# EAGLE board Placa_main_f3 (EAGLE 9.6.2)
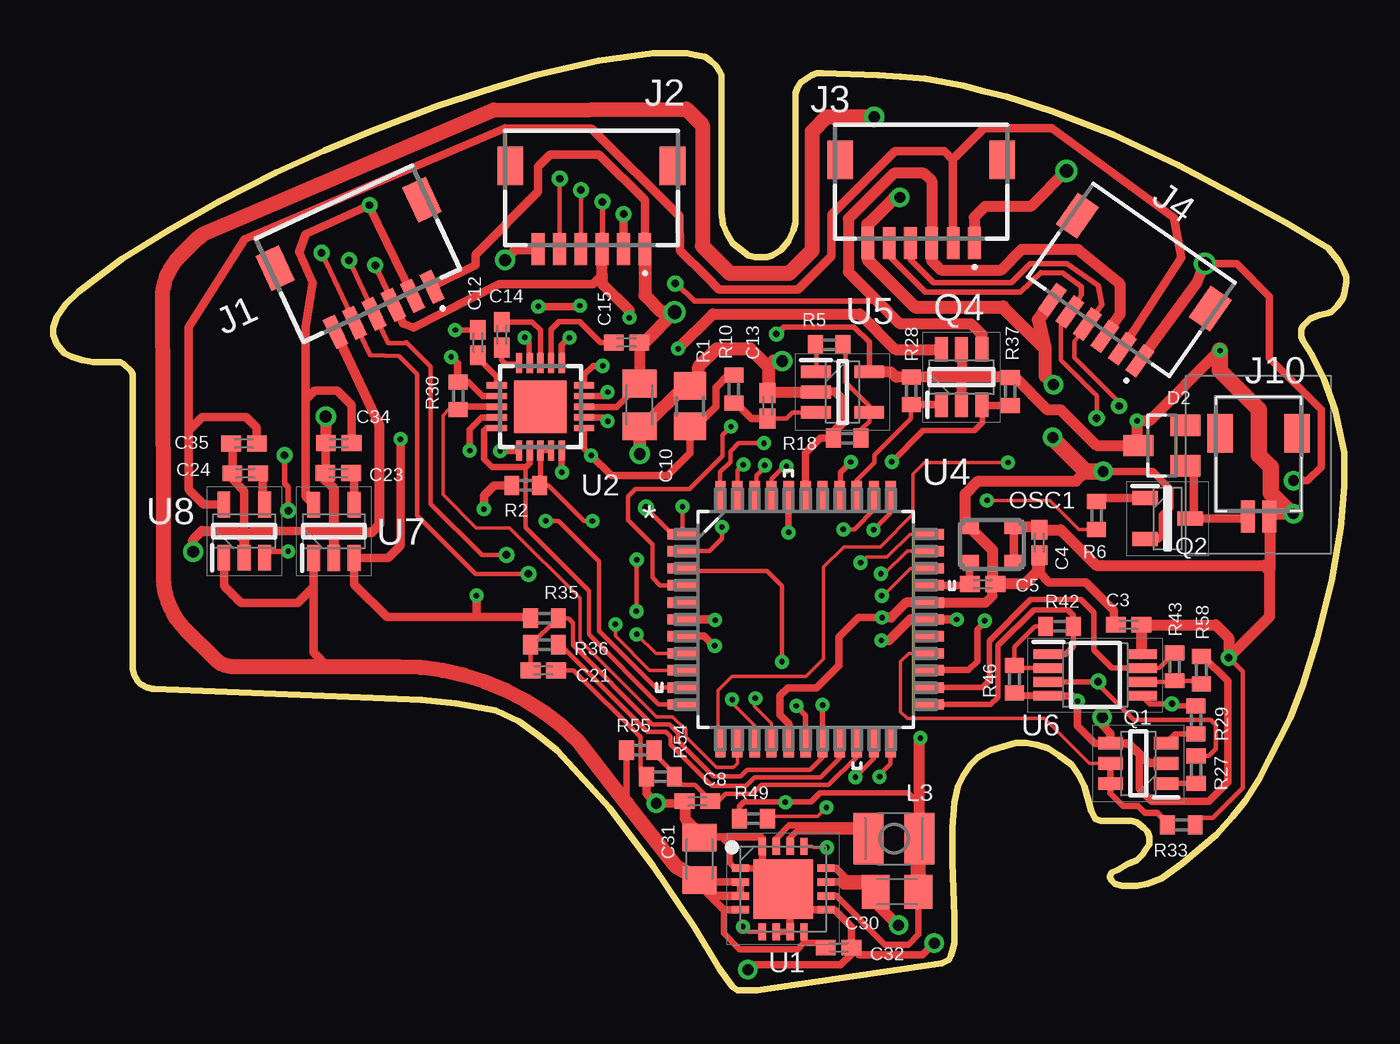
[diagram p7: board, top side]
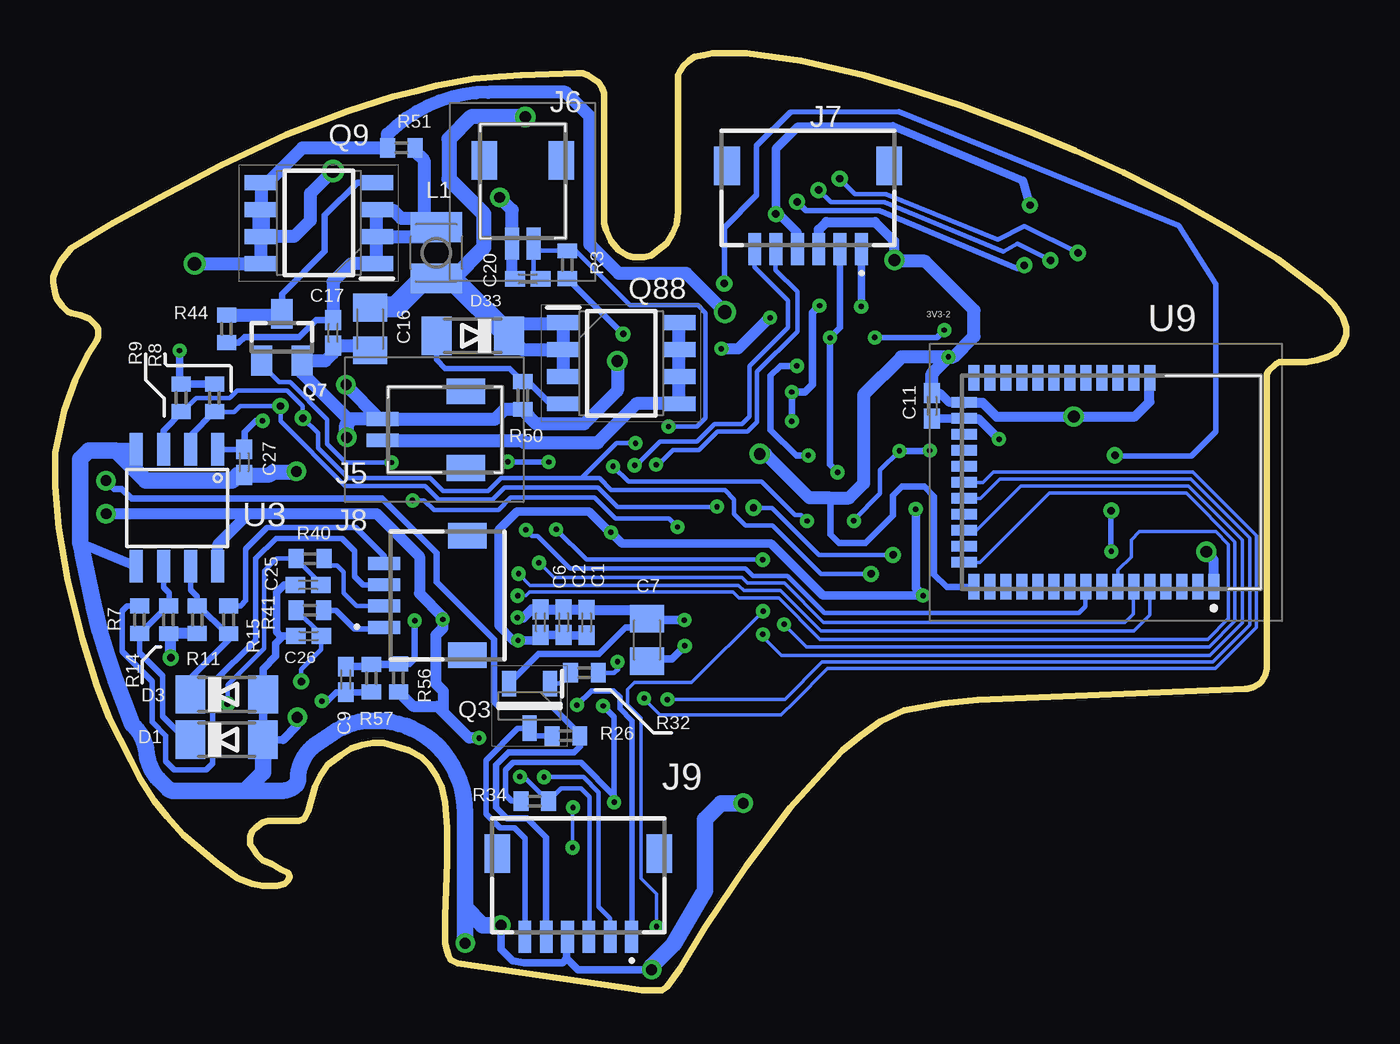
[diagram p8: board, bottom side, seen from below]

Size 60.62 x 43.94 mm. Coordinates in mm from the lower left corner, seen from the top.
Outline: 3.73,28.87 3.73,15.16 arc90 4.74,14.14 17.27,13.63 18.88,13.46 20.74,13.12 21.84,12.62 22.78,11.94 23.62,11.26 24.38,10.41 26.08,8.55 28.11,5.84 30.06,2.96 31.24,1.02 31.84,0.17 32.09,0 33.02,0 41.66,1.27 42,1.44 42.08,1.61 42.16,1.86 42.25,2.2 42.25,3.47 42.16,6.01 42.16,7.62 42.25,8.81 42.42,9.57 42.67,10.08 43.01,10.58 43.35,10.92 43.94,11.26 45.13,11.6 45.64,11.6 46.14,11.51 46.65,11.35 47.16,11.01 47.75,10.58 48.09,10.08 48.35,9.57 48.51,8.97 48.68,8.38 48.85,8.04 49.11,7.96 50.55,7.96 50.8,7.87 51.14,7.62 51.31,7.45 51.39,7.2 51.39,6.86 51.22,6.6 51.05,6.35 50.8,6.1 50.38,5.93 49.95,5.67 49.62,5.5 49.53,5.33 49.62,5.16 49.78,5 50.12,4.91 50.8,4.91 51.31,5 51.99,5.25 52.32,5.5 52.92,5.93 54.53,7.28 55.29,8.13 55.88,8.89 56.56,9.91 56.98,10.75 58,12.78 58.59,14.31 59.27,16.51 59.94,19.22 60.37,21.67 60.54,23.62 60.54,25.23 60.11,27.18 59.61,28.62 59.01,29.8 58.59,30.48 58.51,30.65 58.51,30.99 58.59,31.16 58.93,31.5 59.35,31.67 59.78,31.75 59.94,31.83 60.2,32.09 60.45,32.43 60.54,32.68 60.62,33.19 60.62,33.44 60.54,33.7 60.28,34.21 59.78,34.8 57.83,35.98 55.63,37.17 52.75,38.69 49.7,40.13 46.82,41.23 44.7,41.91 43.6,42.16 42.67,42.42 40.89,42.76 39.71,42.84 38.69,42.93 36.07,43.01 35.81,43.01 35.56,42.93 35.31,42.76 35.05,42.59 34.88,42.33 34.8,42.08 34.8,35.98 34.71,35.64 34.46,35.14 34.12,34.71 33.7,34.46 33.44,34.37 32.94,34.37 32.6,34.46 32.26,34.71 31.84,35.05 31.58,35.48 31.41,35.9 31.33,36.49 31.33,42.93 31.24,43.1 31.07,43.35 30.82,43.6 30.56,43.77 30.14,43.86 29.72,43.94 28.11,43.94 25.57,43.6 22.61,42.93 20.66,42.33 18.03,41.49 14.9,40.3 12.7,39.37 10.41,38.35 7.79,37 5.42,35.64 3.22,34.29 1.19,32.77 0.59,32.17 0.17,31.58 0,31.07 0,30.73 0.17,30.31 0.51,29.89 0.85,29.72 1.35,29.55 1.86,29.46 3.13,29.46 3.3,29.38 3.64,29.04 3.73,28.87
Copper layers (1*16): Top 0.035mm / dielectric 1.5mm / Bottom 0.035mm
Design rules "default *": minimum track width 6mil, minimum drill 10mil, track to track 6mil, track to pad 6mil, pad to pad 6mil, via to via 6mil, smd to smd 6mil, copper to edge 6mil, drill to drill 6mil, minimum pad ring 10mil, minimum via ring 8mil, stop-mask expansion 6mil, vias tented up to drill 0mil, thermal gap 6mil

## Footprints (pad centres in the part's own frame; a part is rotated, then mirrored left to right if it is on the bottom)
C0402K = smd 0.925 x 0.74: 1 -0.6,0; 2 0.6,0
C0805K = smd 1.3 x 1.6: 1 -1,0; 2 1,0
MINIMELF = smd 1.4 x 1.8: A 1.7,0; C -1.7,0
SOT23 = smd 1 x 1.4: 1 -0.95,-1.1; 2 0.95,-1.1; 3 0,1.1
501568-0607 = smd 0.6 x 1.5: 1 -2.5,0.2; 2 -1.5,0.2; 3 -0.5,0.2; 4 0.5,0.2; 5 1.5,0.2; 6 2.5,0.2 | smd 1.2 x 1.8: 7 -3.8,-3.7; 8 3.8,-3.7
5015680207 = smd 0.65 x 1.5: 1 -0.5,2.8; 2 0.5,2.8 | smd 1.2 x 1.8: MP1 -1.8,-1.1; MP2 1.8,-1.1
501568-0407 = smd 0.6 x 1.5: 1 -1.5,0.3; 2 -0.5,0.3; 3 0.5,0.3; 4 1.5,0.3 | smd 1.2 x 1.8: 5 -2.8,-3.6; 6 2.8,-3.6
L2825P = smd 1.4 x 2.4: 1 -1.2,0; 2 1.2,0
ASE = smd 0.9 x 0.65: 1 -1.05,-0.825; 2 1.05,-0.825; 3 1.05,0.825; 4 -1.05,0.825
SOT95P285X140-6N = smd 1.15 x 0.6: 1 -1.3,0.95; 2 -1.3,0; 3 -1.3,-0.95; 4 1.3,-0.95; 5 1.3,0; 6 1.3,0.95
SOT96P240X110-3N = smd 1.2 x 0.65: 1 -1.05,0.96; 2 -1.05,-0.96; 3 1.05,0
SOIC127P600X175-8N = smd 1.525 x 0.7: 1 -2.712,1.905; 2 -2.712,0.635; 3 -2.712,-0.635; 4 -2.712,-1.905; 5 2.712,-1.905; 6 2.712,-0.635; 7 2.712,0.635; 8 2.712,1.905
R0805 = smd 1.3 x 1.5: 1 -0.95,0; 2 0.95,0
R0402 = smd 0.7 x 0.9: 1 -0.65,0; 2 0.65,0
QFN65P400X400X100-17N = smd 0.8 x 0.35: 1 -2,0.975; 2 -2,0.325; 3 -2,-0.325; 4 -2,-0.975; 9 2,-0.975; 10 2,-0.325; 11 2,0.325; 12 2,0.975 | smd 0.35 x 0.8: 5 -0.975,-2; 6 -0.325,-2; 7 0.325,-2; 8 0.975,-2; 13 0.975,2; 14 0.325,2; 15 -0.325,2; 16 -0.975,2 | smd 2.8 x 2.8: 17 0,0
QFN20 = smd 0.95 x 0.3: 1 -2.05,1; 2 -2.05,0.5; 3 -2.05,0; 4 -2.05,-0.5; 5 -2.05,-1; 11 2.05,-1; 12 2.05,-0.5; 13 2.05,0; 14 2.05,0.5; 15 2.05,1 | smd 0.3 x 0.95: 6 -1,-2.05; 7 -0.5,-2.05; 8 0,-2.05; 9 0.5,-2.05; 10 1,-2.05; 16 1,2.05; 17 0.5,2.05; 18 0,2.05; 19 -0.5,2.05; 20 -1,2.05 | smd 2.45 x 2.45: EXP 0,0
SO8-COOL = smd 0.61 x 1.524: 1 -1.905,-2.743; 2 -0.635,-2.743; 3 0.635,-2.743; 4 1.905,-2.743; 5 1.905,2.743; 6 0.635,2.743; 7 -0.635,2.743; 8 -1.905,2.743
QFP80P1200X1200X120-44N = smd 1.473 x 0.483: 1 -5.74,3.988; 2 -5.74,3.2; 3 -5.74,2.388; 4 -5.74,1.6; 5 -5.74,0.787; 6 -5.74,0; 7 -5.74,-0.787; 8 -5.74,-1.6; 9 -5.74,-2.388; 10 -5.74,-3.2; 11 -5.74,-3.988; 23 5.74,-3.988; 24 5.74,-3.2; 25 5.74,-2.388; 26 5.74,-1.6; 27 5.74,-0.787; 28 5.74,0; 29 5.74,0.787; 30 5.74,1.6; 31 5.74,2.388; 32 5.74,3.2; 33 5.74,3.988 | smd 0.483 x 1.473: 12 -3.988,-5.74; 13 -3.2,-5.74; 14 -2.388,-5.74; 15 -1.6,-5.74; 16 -0.787,-5.74; 17 0,-5.74; 18 0.787,-5.74; 19 1.6,-5.74; 20 2.388,-5.74; 21 3.2,-5.74; 22 3.988,-5.74; 34 3.988,5.74; 35 3.2,5.74; 36 2.388,5.74; 37 1.6,5.74; 38 0.787,5.74; 39 0,5.74; 40 -0.787,5.74; 41 -1.6,5.74; 42 -2.388,5.74; 43 -3.2,5.74; 44 -3.988,5.74
SOT95P270X145-5N = smd 1.4 x 0.6: 1 -1.25,0.95; 2 -1.25,0; 3 -1.25,-0.95; 4 1.25,-0.95; 5 1.25,0.95
SOP65P490X110-8N = smd 1.4 x 0.45: 1 -2.2,0.975; 2 -2.2,0.325; 3 -2.2,-0.325; 4 -2.2,-0.975; 5 2.2,-0.975; 6 2.2,-0.325; 7 2.2,0.325; 8 2.2,0.975
SOT95P280X145-5N = smd 1.2 x 0.6: 1 -1.25,0.95; 2 -1.25,0; 3 -1.25,-0.95; 4 1.25,-0.95; 5 1.25,0.95
45300005 = smd 1.2 x 0.5: 1 4.9,4.8; 2 4.9,4.05; 3 4.9,3.3; 4 4.9,2.55; 5 4.9,1.8; 6 4.9,1.05; 7 4.9,0.3; 8 4.9,-0.45; 9 4.9,-1.2; 10 4.9,-1.95; 11 4.9,-2.7; 12 4.9,-3.45; 13 4.9,-4.2; 14 4.9,-4.95; 15 4.9,-5.7; 16 4.9,-6.45; 28 -4.9,-6.45; 29 -4.9,-5.7; 30 -4.9,-4.95; 31 -4.9,-4.2; 32 -4.9,-3.45; 33 -4.9,-2.7; 34 -4.9,-1.95; 35 -4.9,-1.2; 36 -4.9,-0.45; 37 -4.9,0.3; 38 -4.9,1.05; 39 -4.9,1.8 | smd 0.5 x 1.2: 17 3.75,-6.9; 18 3,-6.9; 19 2.25,-6.9; 20 1.5,-6.9; 21 0.75,-6.9; 22 0,-6.9; 23 -0.75,-6.9; 24 -1.5,-6.9; 25 -2.25,-6.9; 26 -3,-6.9; 27 -3.75,-6.9

## Placement (x,y rotation side)
C1  0.1uF  [C0402K]  35.61,17.25 90 bottom
C2  0.1uF  [C0402K]  36.69,17.26 90 bottom
C3  0.1uF  [C0402K]  50.42,17.15 180 top
C4  0.1uF  [C0402K]  46.23,21 270 top
C5  10pF  [C0402K]  43.57,19.05 0 top
C6  0.1uF  [C0402K]  37.78,17.26 90 bottom
C7  10uF  [C0805K]  32.78,16.43 90 bottom
C8  0.1uF  [C0402K]  30.2,8.87 180 top
C9  0.1uF  [C0402K]  46.9,14.58 270 bottom
C10  10uF  [C0805K]  27.48,27.45 90 top
C11  0.1uF  [C0402K]  19.42,27.41 270 bottom
C12  0.1uF  [C0402K]  19.91,30.38 270 top
C13  1uF  [C0402K]  33.49,27.41 90 top
C14  0.1uF  [C0402K]  21.03,30.74 270 top
C15  0.1uF  [C0402K]  26.88,30.38 180 top
C16  10uF  [C0805K]  45.76,31.01 270 bottom
C17  1uF  [C0402K]  47.5,30.83 270 bottom
C20  10uF  [C0402K]  38.37,33.36 180 bottom
C21  0.1uF  [C0402K]  22.97,15.01 0 top
C23  470pF  [C0402K]  13.36,24.25 180 top
C24  470pF  [C0402K]  9,24.25 180 top
C25  1uF  [C0402K]  48.68,19.02 180 bottom
C26  1uF  [C0402K]  48.65,16.62 180 bottom
C27  0.1uF  [C0402K]  51.67,24.77 270 bottom
C30  22uF  [C0805K]  39.56,4.63 180 top
C31  10uF  [C0805K]  30.3,6.17 90 top
C32  1uF  [C0402K]  36.82,2.01 0 top
C34  2.2uF  [C0402K]  13.38,25.66 180 top
C35  2.2uF  [C0402K]  8.94,25.65 180 top
D1  BZT52C3V3LP-7  [MINIMELF]  52.49,11.75 0 bottom
D2  BAT54HT1G  [SOT23]  51.98,25.55 90 top
D3  BZT52C3V3LP-7  [MINIMELF]  52.49,13.88 0 bottom
D33  PLZ9V1A-G3/H  [MINIMELF]  40.95,30.7 180 bottom
J1  501568-0607  [501568-0607]  15.41,32.12 205 top
J2  501568-0607  [501568-0607]  25.23,34.96 180 top
J3  501568-0607  [501568-0607]  40.69,35.24 180 top
J4  501568-0607  [501568-0607]  49.01,31.12 145 top
J5  501568-0207  [5015680207]  42.38,26.29 90 bottom
J6  501568-0207  [5015680207]  38.61,37.82 180 bottom
J7  501568-0607  [501568-0607]  25.23,34.96 180 bottom
J8  501568-0407  [501568-0407]  44.81,18.52 90 bottom
J9  501568-0607  [501568-0607]  36.01,2.72 180 bottom
J10  501568-0207  [5015680207]  56.51,25.02 180 top
L1  68uH  [L2825P]  42.67,34.59 90 bottom
L3  6.8uH  [L2825P]  39.42,7.12 0 top
OSC1  ASDAIG-32.000MHZ-X-K-S-T  [ASE]  44,20.91 180 top
Q1  DMN2215UDM-7  [SOT95P285X140-6N]  50.87,10.64 180 top
Q2  DMN2300U-7DICT-ND  [SOT96P240X110-3N]  52.25,22.12 0 top
Q3  DMN2300U-7DICT-ND  [SOT96P240X110-3N]  38.29,13.34 270 bottom
Q4  DMP2240UDM-7  [SOT95P285X140-6N]  42.59,28.76 90 top
Q7  NTK3134NT1GOSCT-ND  [SOT23]  49.91,30.63 0 bottom
Q9  FDS6675BZCT-ND  [SOIC127P600X175-8N]  48.17,35.98 180 bottom
Q88  FDS6675BZCT-ND  [SOIC127P600X175-8N]  33.99,29.41 0 bottom
R1  0.033R  [R0805]  29.85,27.4 270 top
R2  4k7  [R0402]  22.15,23.68 180 top
R3  1k  [R0402]  36.52,34.03 270 bottom
R5  190k  [R0402]  36.38,30.28 0 top
R6  10k  [R0402]  48.91,22.27 90 top
R7  120R  [R0402]  56.58,17.38 270 bottom
R8  4k7  [R0402]  53.06,27.79 90 bottom
R9  4k7  [R0402]  54.63,27.79 90 bottom
R10  18k  [R0402]  31.91,28.19 90 top
R11  4k7  [R0402]  53.87,17.38 270 bottom
R14  4k7  [R0402]  55.21,17.38 270 bottom
R15  120R  [R0402]  52.4,17.38 270 bottom
R18  10k  [R0402]  37.23,25.9 180 top
R26  100R  [R0402]  36.58,11.94 0 bottom
R27  10k  [R0402]  53.59,10.35 90 top
R28  1k  [R0402]  40.23,28.11 90 top
R29  10k  [R0402]  53.57,12.68 90 top
R30  10k  [R0402]  18.98,27.88 270 top
R32  10k  [R0402]  35.72,14.89 180 bottom
R33  10k  [R0402]  52.89,7.76 0 top
R34  4k7  [R0402]  38.04,8.88 180 bottom
R35  10k  [R0402]  23.03,17.45 0 top
R36  470R  [R0402]  23.03,16.21 0 top
R37  1k  [R0402]  44.86,28.08 90 top
R40  27k  [R0402]  48.58,20.25 180 bottom
R41  27k  [R0402]  48.59,17.82 180 bottom
R42  10K  [R0402]  47.18,17.07 180 top
R43  10K  [R0402]  52.58,15.17 270 top
R44  10k  [R0402]  52.5,31.02 270 bottom
R46  100K  [R0402]  45.06,14.59 270 top
R49  1M  [R0402]  32.83,8.06 180 top
R50  2k2  [R0402]  38.61,27.9 90 bottom
R51  10k  [R0402]  44.3,39.51 180 bottom
R54  10k  [R0402]  28.46,10.02 0 top
R55  39k  [R0402]  27.52,11.26 180 top
R56  10k  [R0402]  44.44,14.65 90 bottom
R57  10k  [R0402]  45.71,14.64 90 bottom
R58  100K  [R0402]  53.83,15.02 90 top
U1  TPS62111RSAT  [QFN65P400X400X100-17N]  34.22,4.75 0 top
U2  A3906SESTR-T  [QFN20]  22.84,27.37 0 top
U3  ADUM1250  [SO8-COOL]  54.82,22.63 180 bottom
U4  DSPIC33FJ128MC804-I/PT  [QFP80P1200X1200X120-44N]  35.28,17.4 0 top
U5  MCP601T-I_OT  [SOT95P270X145-5N]  37.01,28.06 0 top
U6  MCP6002T-I_MS  [SOP65P490X110-8N]  48.85,14.79 0 top
U7  MIC5219-5.0YM5-TR  [SOT95P280X145-5N]  13.16,21.53 90 top
U8  MIC5219-5.0YM5-TR  [SOT95P280X145-5N]  8.95,21.53 90 top
U9  BL651 - 453-00005  [45300005]  11.01,23.82 270 bottom

## Tracks (layer width: path | path; a pad name or v marks a point on that pad's centre or on a via)
+3V3  (via drill 0.25, 0.3, 0.35, 0.51)
  Top 0.203: R33.2 53.86,8.08 54.36,8.08 55.77,9.49 55.77,14.95 v55.11,15.6
  Top 0.254: R49.2 32.18,8.63 32.39,8.84 34.3,8.84 v34.32,8.82 34.34,8.84 35.53,8.84 35.94,9.25 40.08,9.25 40.56,8.77 40.56,7.06 | 51.02,15.76 U6.8 | v34.84,13.34 35.28,12.9 U4.17 | U5.5 38.26,30.39 37.54,31.11 34.26,31.11 33.93,30.78 v33.9,30.78
  Top 0.305: 40.57,4.62 40.57,2.62 40.09,2.14 39,2.14 36.71,4.43 U1.10 | R35.1 22.32,17.5 | 19.84,17.52 19.86,17.5 | v34.47,21.48 34.47,23.12 U4.40 | 50.71,25.55 50.87,25.55
  Top 0.356: C30.1 40.57,4.62 | C4.1 46.09,21.74 | OSC1.1
  Top 0.406: U4.28 v42.36,17.4 v42.36,17.39 | 39.19,16.41 v38.83,16.41 | R2.2 20.66,23.68 20.19,23.21 v20.19,22.57 | OSC1.1 OSC1.4 | 22.32,17.5 19.86,17.5 15.65,17.5 14.11,19.04 U7.3 15.7,20.28 16.28,20.85 v16.28,25.85 | v19.84,18.51 19.84,17.52
  Top 0.457: U4.28 40.17,17.39 39.19,16.41 | Q4.5 42.59,28.75 Q4.2
  Top 0.508: 46.09,21.74 OSC1.1 | C4.1 47.24,21.6 48.91,19.93 56.77,19.93 57.03,19.67 | 51.02,15.76 C3.1 54.5,17.15 55.11,16.53 v55.11,15.6 57.03,17.51 57.03,19.67 | U5.5 39.27,29 39.52,28.76 R28.2 40.24,28.75 42.59,28.75 44.84,28.75 R37.2 45.11,28.73 46.62,27.22 47.24,27.22 48.91,25.55 50.71,25.55 D2.3 50.81,25.62 v50.81,26.71 51.38,26.71 54.68,30 v54.7,30 | L3.2 40.62,11.8 v40.66,11.83 | 57.03,19.67 57.03,22.2 J10.1 57.01,22.29 57.07,22.35
  Top 0.61: v58.15,22.35 57.07,22.35
  Top 0.711: C30.1 40.56,7.06 L3.2
  Top 0.762: v54.7,30 54.7,29.06 56.52,27.24 56.52,25.1 57.08,24.55 57.08,23.32 58.05,22.35 v58.15,22.35
  Bottom 0.203: 44.39,14.05 R56.1
  Bottom 0.254: C27.1 U3.1 | v34.84,13.34 34.32,12.82 v34.32,8.82 34.32,9.13 35.88,10.69 39.06,10.69 39.42,10.33 39.42,9.17 39.13,8.88 R34.2 | v33.9,30.78 33.92,30.78 R3.2
  Bottom 0.305: 34.51,21.48 v34.47,21.48 | v50.81,26.71 51.14,26.71 51.66,26.18 C27.1
  Bottom 0.356: v54.7,30 54.7,28.52 R9.2 R8.2
  Bottom 0.406: v38.83,16.41 v38.82,16.4 37.78,16.4 C6.1 C2.1 36.68,16.65 C1.1 | C11.2 U9.26 17.25,26.82 v16.28,25.85 | v20.19,22.57 20.17,22.55 20.17,18.84 v19.84,18.51 24.54,18.51 26.98,20.95 33.95,20.95 v34.47,21.48 | 39.06,16.41 39.75,17.11 39.75,21.59 38.89,22.46 35.49,22.46 34.51,21.48
  Bottom 0.457: v38.83,16.41 39.06,16.41
  Bottom 0.508: R56.1 43.76,13.32 42.61,13.32 42.34,13.06 | 42.34,13.06 42.34,14.04 42.7,14.39 42.7,16.64 42.36,16.98 v42.36,17.39 42.36,17.52 43.46,18.61 43.46,20.35 45.45,22.34 51.49,22.34 | v40.66,11.83 41.12,11.83 42.34,13.06 | U3.8 52.92,20.92 51.49,22.34 | 51.49,22.34 58.13,22.34 v58.15,22.35 | R11.2 55.21,16.73 | 55.21,16.73 R14.2 | v55.11,15.6 55.11,16.63 55.21,16.73
+3V3-1  (via drill 0.25, 0.35)
  Top 0.203: 25.75,34.77 J2.3
  Top 0.254: J1.3 v15.09,34.01 | v25.75,36.98 25.75,34.77
  Top 0.406: 25.74,33.55 25.3,33.11 20.91,33.11 16.9,31.07 16.39,31.26 J1.3
  Top 0.508: J2.3 25.74,33.55 25.74,33.15 27.01,31.88 v27.01,31.55 | v29.3,30.09 30.92,31.71 37.82,31.71 39.47,30.05 Q4.6
  Bottom 0.254: v15.09,34.01 15.41,33.85 21.89,36.57 25.33,36.57 v25.75,36.98
  Bottom 0.508: v29.3,30.09 28.51,30.09 27.05,31.55 v27.01,31.55
+3V3-2  (via drill 0.25, 0.35)
  Top 0.254: 38.69,32.27 38.68,32.27 | 38.64,32.32 30.06,32.32 29.22,33.15 v29.16,33.15 | v11.01,20.59 v11,20.58 10.2,20.58 U8.3 | v11.02,22.5 11.02,23.61 10.84,23.78 v10.84,25.09
  Top 0.508: J4.3 50.03,31.7 50.03,33.12 48.05,34.74 45.4,34.74 44.44,33.78 41.61,33.78 41.19,34.2 J3.3 41.19,37.96 40.83,38.32 39.41,38.32 37.28,36.19 37.28,33.68 38.69,32.27 | 38.64,32.32 38.68,32.27 39.7,31.25 43.05,31.25 43.54,30.76 Q4.4
  Bottom 0.254: v29.16,33.15 29.16,35.76 27.64,37.28 27.64,39.6 26.05,41.19 20.96,41.21 7.85,35.86 6.12,33.12 6.12,26.2 7.26,25.06 10.81,25.06 v10.84,25.09 | v11.01,20.59 11.03,20.6 11.03,22.49 v11.02,22.5
+5V/1  (via drill 0.35)
  Top 0.406: J1.2 | J1.2 14.8,36.79 v14.83,36.82 11.82,35.46 11.53,34.61 12.15,33.18 11.82,31.12 11.82,27.7 | v26.74,36.4 v26.73,36.4 J2.2 | U7.5 11.82,23.16 11.82,27.7 | C34.1 13.98,27.45 13.31,28.13 12.25,28.13 11.82,27.7
  Bottom 0.406: v14.83,36.82 15.15,37.97 21.26,40.52 25.71,40.49 26.74,39.47 v26.74,36.4 26.6,36.4 25.73,35.54 J7.4
+5V/2
  Top 0.406: C35.1 9.54,26.39 9.04,26.89 6.97,26.89 6.34,26.26 | 6.34,26.26 6.34,23.49 7.05,22.78 U8.5 | 6.34,26.26 6.34,31.1 8.98,35.24 21.17,40.43 25.24,40.41 29.36,36.31 29.38,34.7 30.6,33.49 31.22,32.87 34.93,32.87 36.49,34.43 36.49,36.38 39.46,39.35 41.78,39.35 42.19,38.94 J3.2 42.19,38.98 43.63,40.42 46.83,40.42 52.54,36.23 52.9,34.36 J4.2
BOT_EXT  (via drill 0.25)
  Top 0.203: v31.77,26.44 31.37,26.04 31.37,25.06 29.82,23.51 27.3,23.51 26.94,23.15 26.94,22.06 28.09,20.91 28.09,19.36 28.45,19 U4.4
  Bottom 0.203: C20.1 38.11,33.7 J6.1 37.78,34.69 36.53,34.69 R3.1 36.14,34.68 33.59,32.13 30.4,32.13 30.04,31.76 30.04,26.84 30.44,26.44 v31.77,26.44
BUZZER
  Bottom 0.254: R26.1 38.16,11.94 38.27,12.04 38.27,12.26 Q3.3 38.84,12.29 40.34,10.79 40.34,8.28 39.67,7.62 39,7.62 38.51,7.12 J9.6
CA  (via drill 0.35)
  Top 0.203: v48.99,14.48 48.99,14.34 50.66,12.67 54.27,12.67 54.51,12.44 54.51,11.33 54.18,11 R27.2
  Top 0.254: v48.99,14.48 48.98,14.46 U6.3
  Bottom 0.203: R41.2 49.21,17.82 48.05,16.66 C26.1 48.05,16 48.99,15.06 v48.99,14.48
CB  (via drill 0.3)
  Top 0.254: R29.2 52.56,13.33 v52.45,13.44 51.42,13.44 U6.5
  Bottom 0.203: C25.1 48.08,19.08 49.23,20.23 R40.2 50.15,20.25 50.73,19.67 50.73,16.04 52.45,14.32 v52.45,13.44
ECA  (via drill 0.25)
  Top 0.2: v33.36,24.62 33.36,24.54 32.97,24.14 32.97,23.22 U4.42
  Bottom 0.2: J7.6 27.73,33.92 26.16,32.36 26.16,31.08 27.97,29.27
  Bottom 0.203: v33.36,24.62 33.31,24.62 32.18,25.74 30.43,25.74 29.62,26.55 28.33,26.55 27.97,26.91 27.97,29.27
ECB  (via drill 0.25)
  Top 0.2: v32.36,24.65 32.08,24.37 U4.43
  Bottom 0.203: v32.36,24.65 32.25,24.65 31.57,25.33 30.34,25.33 29.48,26.2 28.06,26.2 27.62,26.64 27.62,29.02 25.74,30.89 25.74,32.77 26.75,33.79 26.75,34.74 J7.5
EMG_A
  Top 0.254: U6.1 47.45,15.76 47.82,16.14 R42.1 47.83,17.59 47.57,17.85 45.98,17.85 44.29,16.16 44.29,13.74 43.95,13.4 U4.23
EMG_B
  Top 0.203: R43.1 51.87,15.11 U6.7
  Top 0.254: U4.24 43.56,14.2 43.89,14.52 43.89,16.39 45.81,18.32 48.18,18.32 48.79,17.72 48.79,15.97 49.64,15.11 U6.7
FLAG_BUZ  (via drill 0.25)
  Top 0.203: U4.3 29.65,19.67 33.45,19.67 34.16,18.96 v34.16,15.4
  Bottom 0.203: R32.1 34.33,14.89 34.16,15.06
  Bottom 0.254: v34.16,15.4 34.16,15.06
FLAG_DRV  (via drill 0.25)
  Top 0.203: v34.38,24.57 34.27,24.57 33.68,23.98 U4.41 | v25.28,22.01 24.89,22.01 23.22,23.68 R2.1
  Top 0.254: R2.1 22.85,23.73 U2.8 U2.9
  Bottom 0.203: v34.38,24.57 33.66,23.85 27.41,23.85 25.84,22.29 25.56,22.29 v25.28,22.01
FLAG_V1
  Top 0.203: U4.36 37.66,23.9 38.5,24.74 38.5,25.11 40.22,26.82 40.22,27.44 R28.1
  Top 0.356: R28.1 41.63,27.46 Q4.1
FLAG_V2  (via drill 0.25)
  Top 0.254: U4.37 36.9,23.16 36.9,24.28 v37.4,24.78 | v39.32,24.79 40.78,26.25 43.18,26.25 43.56,26.63 43.56,27.43
  Top 0.356: R37.1 43.56,27.43 Q4.3
  Bottom 0.254: v39.32,24.79 39.31,24.78 v37.4,24.78
FLAG_VM  (via drill 0.25)
  Top 0.152: 31.17,11.78 31.17,14.06 31.83,14.72 35.28,14.72 36.12,15.55 36.12,19.84 37.07,20.8 38.78,20.8 40.31,22.33 40.31,24.22 40.85,24.75 v44.77,24.75
  Top 0.203: U4.12 31.17,11.78
  Bottom 0.203: v44.77,24.75 46.91,24.75 47.78,25.62 47.78,26.78 49.53,28.53 50.04,28.53 50.86,29.34 Q7.1
GND  (via drill 0.25, 0.51, 0.55)
  Top 0.203: R54.1 27.53,10.3 27.53,11.87 24.4,15.01 C21.2 | C13.2 33.53,28.05 | U5.2 35.78,28.08 | R18.2 36.58,26.18
  Top 0.305: U1.17 33.25,5.73 U1.1 31.97,5.73 31.7,5.99 31.7,6.79 31.3,7.19 30.33,7.19 | U1.6 U1.7 | 52.15,10.66 Q1.2 | U2.2 20.13,27.87 19.47,28.53 R30.1
  Top 0.33: U6.4 46.64,13.8 45.26,13.8 45.11,13.94 R46.2
  Top 0.356: 30.48,7.19 33.16,7.19 33.25,7.1 U1.16 33.26,5.94 34.22,4.97 U1.17 | U1.7 34.55,4.43 U1.17 | U1.11 36.87,5.08 37.05,4.89 38.29,4.89 C30.2 38.56,5.24 37.2,5.24 36.71,5.73 U1.12 | U1.17 35.2,3.78 U1.9 36.62,3.78 37.42,2.98 C32.2 | C8.2 29.5,8.77 | v31.03,17.37 31,17.4 | 44.04,19.19 C5.2 | Q1.4 48.84,11.59 48.03,12.4 v48.03,13.57 47.78,13.81 U6.4 | U4.39 35.28,25.21 35.96,25.9 R18.2 | R58.2 53.91,15.67 55.06,14.51 55.06,9.74 54.17,8.85 51.51,8.85 50.92,9.44 50.92,11.03 50.95,11.06 | Q2.2 51.82,21.16 52.01,21.34 52.01,22.28 52.36,22.64 52.36,23.52 51.55,24.33 v49.22,24.33 | U4.16 | U4.16 34.49,12.5 34.08,12.91 34.08,13.82 34.45,14.19 35.79,14.19 36.84,15.24 36.84,16.56 37.76,17.48 v38.86,17.48 | R30.1 18.96,28.54 18.96,28.65 18.96,28.64 18.96,29.4 v18.65,29.7 | v32.57,0.97 32.6,0.97 32.82,1.19 36.92,1.19 37.42,1.7 C32.2 | v41.31,2.21 40.76,1.66 37.77,1.66 C32.2 | R1.1 29.59,28.35
  Top 0.406: 29.5,8.77 v28.27,8.77 27.81,9.23 R54.1 | 31,17.4 U4.6 | 52.15,10.66 51.35,10.66 50.95,11.06 50.42,11.59 Q1.4 49.57,12.05 49.18,12.45 v49.18,12.8 | 35.78,28.08 36.64,28.08 37.02,27.7 37.02,26.63 36.58,26.18 | 12.78,24.22 12.76,24.23 C23.2 12.76,25.64 C34.2 | C35.2 8.4,25.58 C24.2 8.4,23.97 8.95,23.42 U8.2 8.95,21.14 9.34,21.53 12.76,21.53 13.13,21.16 13.13,20.3 U7.2 | C3.2 49.72,17.24 49.72,17.82 48.42,19.13 46.69,19.13 46.23,19.59
  Top 0.457: v38.86,17.48 39.28,17.48 39.98,18.18 U4.29 43.72,18.18 44.04,18.5 44.04,19.19 | U8.2 8.96,21.12 8.54,21.54 6.96,21.54 6.56,21.14 v6.56,20.57 | C23.2 12.76,23.92 13.13,23.55 13.13,21.49 | 13.13,21.49 13.13,20.3 | 13.13,21.49 14.94,21.49 15.3,21.85 15.3,26.51 J1.6 | v21.18,34.25 21.7,34.76 J2.6
  Top 0.508: v39.63,3.06 39.6,3.06 38.56,4.09 C30.2 | 44.04,19.19 44.04,20.64 OSC1.2 42.76,21.92 42.76,23.28 43.36,23.88 47.95,23.88 48.41,24.33 | C4.2 46.23,19.59 | 46.14,20.24 46.14,19.64 45.56,19.05 C5.2 | U5.2 33.53,28.05 33.53,29.26 | C8.2 29.63,8.84 29.63,8.05 30.48,7.19 | J4.6 46.84,32.3 | 46.49,28.81 v46.9,28.41 | J3.6 38.21,35.02 | v46.87,25.93 46.87,25.87 | v12.77,26.91 12.77,25.65 12.76,25.64
  Top 0.61: J3.6 38.19,35.91 39.46,37.18 v39.7,37.18 | 38.21,35.02 38.21,34.25 40.41,32.05 44.54,32.05 46.5,30.08 | v46.9,28.41 46.5,28.8 46.5,30.08 | J4.6 46.18,31.45 46.5,30.08 | v34.18,29.51 33.79,29.51 33.53,29.26 | 29.59,28.35 27.69,26.45 | 27.69,26.45 C10.1 | R1.1 30.26,28.75 30.26,29.24 31.11,30.1 32.67,30.1 33.53,29.23 33.53,28.05 | v27.5,25.15 27.5,26.26 27.69,26.45
  Top 0.711: 30.33,7.19 C31.2
  Top 0.762: v49.22,24.33 48.41,24.33 46.87,25.87
  Bottom 0.203: C20.2 39.11,33.5
  Bottom 0.305: v48.03,13.57 v48.02,13.56 47.77,13.56 47.35,13.98 C9.2 45.72,13.98 R57.1 | Q3.2 37.87,15.77 35.03,15.77 33.8,17.01 33.21,17.01 C7.2 | U9.16 18.73,18.91 19.32,19.51 19.32,23.16 19.79,23.62 20.83,23.62 21.26,23.19 21.26,22.27 22.54,20.99 23.79,20.99 24.18,21.38 24.18,23.01 24.27,23.1
  Bottom 0.356: J9.4 36.55,2.56 36.55,1.51 36.55,1.5 | 36.55,1.5 36.76,1.3 38.56,1.3 39.08,1.38 39.63,1.93 v39.63,3.06 | C1.2 35.63,17.86 | 32.72,17.37 C7.2 | C25.2 49.8,19.02 50.15,18.66 50.15,16.8 49.98,16.62 49.85,16.62 | 49.85,16.62 C26.2 | D3.A 50.79,15.08 50.2,15.67 50.2,16.27 49.85,16.62 | D1.A 49.86,11.75 | v32.57,0.97 36.02,0.97 36.55,1.5
  Bottom 0.406: C2.2 | 32.72,17.37 v31.03,17.37 | 33.2,17.85 C7.2 | U9.27 | U9.27 18.61,27.57 19.05,28.01 C11.1 | D1.A D3.A | v49.18,12.8 49.18,12.43 49.86,11.75
  Bottom 0.457: C2.2 35.63,17.86 | C2.2 C6.2 38.19,17.86 38.57,17.48 v38.86,17.48 | C1.2 33.2,17.85 | 12.76,26.89 16.38,26.89 17.04,27.55 17.89,27.55 | U9.39 9.22,28.71 9.22,27.59 9.9,26.91 v12.77,26.91 | U9.1 6.21,20.02 6.21,20.2 6.56,20.56 v6.56,20.57 | J7.3 24.73,35.68 24.38,36.03 22.09,36.03 21.2,35.14 21.2,34.26 v21.18,34.25 | U3.5 59.34,20.97 arc45 59.37,20.98
  Bottom 0.508: 39.11,33.5 J6.2 | 45.98,30.23 C16.2 | 49.25,24.31 v49.22,24.33 | 46.59,26.79 45.59,26.79 | 17.89,27.55 U9.27 | R50.1 38.61,27.2
  Bottom 0.61: R50.1 39.46,27.25 39.92,26.78 J5.2 | J5.2 45.59,26.79 46.79,26.79 48.96,28.95 Q7.2 47.86,29.53 47.5,29.88 C17.2 45.98,30.23 | J5.2 45.32,26.79 46.9,28.37 v46.9,28.41 | J6.2 39.11,36.6 v39.7,37.18 | 46.87,26.52 46.59,26.79 | v18.65,29.7 20.86,29.7 22.63,27.94 22.63,23.77 23.3,23.1 24.27,23.1 25.17,23.1 27.22,25.15 v27.5,25.15 | C11.1 19.42,28.92 19.37,28.96 19.37,28.98 v18.65,29.7 | v12.77,26.91 12.76,26.89 | v18.65,29.7 18.42,29.7 17.45,30.67 17.45,31.9 19.75,34.19 21.13,34.19 v21.18,34.25 | 38.61,27.2 37.98,26.57 35.72,26.57 34.17,28.12 v34.17,29.5 v34.18,29.51 | U3.4 57.64,25.37 57.69,25.31
  Bottom 0.711: C27.2 50.47,24.17 50.33,24.31 49.25,24.31 | v46.87,25.93 46.87,26.52
  Bottom 0.762: D1.A 50.79,10.21 51.64,9.36 | 51.64,9.36 55.01,9.36 arc45 55.23,9.45 55.67,9.89 arc39 56.25,11.11 arc-41 56.91,12.48 57.71,14.58 arc8 58.73,18.01 59.24,20.47 arc1 59.34,20.97 | 59.37,20.98 59.37,24.91 58.97,25.31 57.69,25.31 56.29,23.91 52.24,23.91 51.98,24.17 C27.2 | 51.64,9.36 49.86,9.36 arc-45 49.27,9.61 arc-45 49.14,9.92 arc58 48.2,11.61 arc-4 47.57,12.03 arc38 45.47,12.64 arc45 42.61,11.46 arc45 41.31,8.31 41.31,3.88 | 41.31,3.88 40.48,3.06 v39.63,3.06 | v28.27,8.77 29.31,8.77 30.07,8.02 30.07,4.76 arc45 30.16,4.54 31.53,2.16 32.57,1.12 v32.57,0.97 | 41.31,3.88 v41.31,2.21
I_MOTOR
  Top 0.203: R5.1 35.78,30.23 35.78,29.02 U5.1
INT_EMG
  Top 0.152: U4.26 41.01,15.81 40.12,15.81 39.73,15.42 39.73,13.06 40.04,12.74 46.47,12.74 48.57,10.64 Q1.5
  Top 0.305: Q1.5 Q1.6 49.57,9.24 50.16,8.66 50.85,8.66 51.19,8.32 51.77,8.32 52.24,7.85 R33.1
MCLR_PIC  (via drill 0.25)
  Top 0.203: U4.18 36.06,10.93 35.47,10.34 32.53,10.34 32.22,10.03 30.96,10.03 29.29,11.71 29.29,12.08 28.9,12.48 28.08,12.48 24.37,16.19 24.37,17.24 24.16,17.45 R35.2 23.65,17.45 22.41,16.21 R36.1 C21.1
  Top 0.254: U4.18 v36.06,13.37 v36.07,13.38
  Bottom 0.254: J9.1 33.48,2.55 33.48,5.21 33.48,12.64 34.06,13.22 34.06,13.77 34.35,14.05 35.39,14.05 v36.06,13.38 v36.07,13.38
MOTOR_VIBRA  (via drill 0.25)
  Top 0.152: R6.1 48.1,21.61 46.74,22.98 v43.78,22.98 | U4.2
  Top 0.203: v31.36,21.73 31.36,21.19 30.77,20.6 U4.2
  Bottom 0.203: v31.36,21.73 31.75,22.12 34.26,22.12 35.24,23.1 39.17,23.1 39.75,22.52 42.77,22.52 43.23,22.98 v43.78,22.98
MS_BT  (via drill 0.25)
  Top 0.152: v31.83,13.63 31.83,13.48 32.89,12.42 U4.14
  Bottom 0.152: U9.21 17.14,23.07 16.24,23.98 7.3,23.98 4.53,21.21 4.53,17.13 6.26,15.4 24.58,15.4 26.33,13.65 31.81,13.65 v31.83,13.63
N$1
  Bottom 0.254: R7.1 57.15,18.03 57.39,17.78 57.39,15.89 55.99,14.49 55.99,12.59 55.34,11.94 55.34,10.73 54.95,10.34 53.45,10.34 53.14,10.65 53.14,14.41 51.14,16.41 51.14,20.24 50.18,21.2 47.09,21.2 46.49,20.6 46.49,19.41 46.11,19.02 J8.3
N$2
  Bottom 0.254: U3.7 54.19,18.78 53.87,18.47 R11.1 53.81,18.03 52.5,16.72 R15.2 52.4,16.43 54.21,14.62 54.21,13.9 D3.C
N$3  (via drill 0.25)
  Top 0.356: U4.7 30.51,16.61 30.96,16.15 v31.01,16.15
  Bottom 0.356: C7.1 32.67,15.55 31.62,15.55 v31.01,16.15
N$4  (via drill 0.25)
  Top 0.254: U4.25
  Top 0.305: U4.25 42.91,15.02 43.32,15.43 43.32,16.93 43.68,17.28 v43.68,17.33
  Bottom 0.305: R56.2 43.91,15.3 43.68,15.54 v43.68,17.33
  Bottom 0.356: C9.1 45.83,15.18 R57.2 R56.2
N$5
  Top 0.254: R27.1 Q1.1
N$6
  Top 0.406: Q2.1 49.08,23.08 R6.2
N$7
  Top 0.254: R29.1 52.61,12.03 Q1.3
N$8
  Top 0.203: C13.1 34.37,26.81 34.66,27.1 U5.3
  Top 0.356: C13.1 32.73,26.81 32,27.54 R10.1
N$9
  Bottom 0.305: R44.2 51.93,30.37 51.66,30.64 49.1,30.64 48.31,31.43 C17.1
  Bottom 0.61: L1.2 43.09,36.21 44.31,36.21 44.69,36.58 45.43,36.58 Q9.3 Q9.1 46.66,34.08 47.5,33.23 C17.1 | Q9.2 43.11,35.34 L1.2 | R51.1 43.65,39.32 43.25,38.92 43.25,36.37 L1.2
N$10
  Bottom 0.305: Q9.4 46.35,37.88 47.89,36.35 47.89,34.66 49.9,32.64 Q7.3
  Bottom 0.61: R44.1 49.96,31.67 Q7.3
N$11
  Top 0.406: U8.4 9.82,22.87 9.82,24.03 C24.1
N$12
  Top 0.406: C23.1 14.11,24.11 U7.4
N$13
  Top 0.254: C12.2 20.1,29.58 20.1,29.46 20.79,28.78 U2.1
N$14  (via drill 0.25)
  Top 0.152: U1.13 35.58,6.75 35.64,6.69 v36.28,6.69 | v36.25,8.58 35.83,8.16 33.58,8.16 R49.1
  Bottom 0.152: v36.28,6.69 36.28,8.55 v36.25,8.58
N$15
  Top 0.305: U1.14 34.55,7.16 34.85,7.46 37.88,7.46 L3.1 37.6,7.74 34.5,7.74 33.9,7.13 U1.15
N$16
  Bottom 0.254: D33.A 42.65,29.58 42.24,29.17 39.23,29.17 R50.2 38.37,28.55 37.33,27.51 Q88.4
N$17
  Top 0.254: U2.18 22.84,30.12 22.84,30.13 22.84,30.95 22.45,31.34 C14.1
N$19
  Top 0.203: U4.20 37.67,11.65 37.67,10.95 36.35,9.63 33.2,9.63 32.79,9.22 31.52,9.22 31.16,8.87 C8.1 30.82,8.88 30.82,8.91 30.1,9.63 29.51,9.63 R54.2 29.11,10.17 28.17,11.11 R55.1
N$20
  Top 0.254: C15.2 25.65,30.38 24.68,31.36 23.71,31.36 23.34,30.99 U2.17
N$21
  Top 0.254: C14.2 21.03,29.57 21.23,29.37 21.79,29.37 U2.20
N$22
  Top 0.356: U4.30 42.92,19 C5.1 42.95,19.08 OSC1.3
N$23
  Top 0.203: U4.19 36.88,10.9 35.96,9.99 32.88,9.99 32.48,9.58 30.88,9.58 28.94,11.52 28.94,11.91 28.74,12.11 27.85,12.11 23.76,16.21 R36.2
N$24
  Top 0.406: D2.1 53.47,24.21 53.47,22.29 Q2.3 55.91,22.12 J10.2
N$25  (via drill 0.25)
  Top 0.254: U2.19 22.32,29.44 22.32,30.38 22.1,30.59 v22.1,30.61 | C12.1 19.89,30.96 v18.84,30.96
  Bottom 0.254: v18.84,30.96 19.19,30.61 v22.1,30.61
N$26
  Top 0.203: R5.2 37.14,30.17 37.14,28.52 38.26,27.41 U5.4 38.26,26.68 37.88,26.3 R18.1
N$27
  Bottom 0.254: J8.4 45.11,20.38 46.45,21.71 50.59,21.71 51.59,20.7 51.59,18.27 51.84,18.02 R15.1
N$29
  Bottom 0.2: Q3.1 36.87,14.39 R32.2
N$30
  Top 0.203: R42.2 46.03,17.07 45.06,16.1 R46.1 45.14,15.24 45.27,15.11 U6.2
N$31
  Top 0.203: U6.6 52.52,14.46 R43.2 53.67,14.52 R58.1
N$32
  Bottom 0.254: U3.6 55.46,18.89 55.19,18.63 55.19,18.05 R14.1 55.25,18.03 56.54,16.73 R7.2 56.58,15.83 55.49,14.74 55.49,12.85 54.39,11.75 D1.C
N$33
  Bottom 0.203: R40.1 47.61,19.93 47.32,19.93 47.01,19.62 47.01,18.64 46.39,18.02 J8.2
N$34
  Bottom 0.254: J8.1 45.17,16.96 46.49,16.96 47.35,17.82 R41.1
NRESET_BT  (via drill 0.25)
  Top 0.152: v38.85,18.51 38.92,18.51 40.2,19.78 U4.31
  Bottom 0.152: U9.7 10.71,19.7 10.08,20.33 10.08,21.13 9.69,21.51 6.12,21.51 5.52,20.91 5.52,17.44 6.49,16.46 24.67,16.46 26.61,18.4 28.47,18.4 28.75,18.68 38.29,18.68 38.47,18.51 v38.85,18.51
OUT_M1  (via drill 0.25)
  Top 0.305: U2.10 v23.84,24.3 v23.84,24.29 | U2.16 | v24.2,30.61 23.84,30.25 U2.16
  Bottom 0.305: v23.84,24.29 24.2,24.65 v24.2,30.61 23.73,31.07 J7.2
OUT_M2  (via drill 0.25)
  Top 0.305: U2.12 25.82,26.87 v25.99,26.69 | v26,28.06 25.81,27.87 U2.14
  Top 0.356: v22.74,32.07 v22.75,32.07 24.66,32.07 v24.7,32.11
  Bottom 0.305: v25.99,26.69 v25.99,28.06 v26,28.06
  Bottom 0.356: v26,28.06 25.38,28.06 25.03,28.41 25.03,31.78 v24.7,32.11 | J7.1 v22.73,32.08 v22.74,32.07
PGD_PIC  (via drill 0.25)
  Top 0.203: U4.21 38.48,10.88 37.61,10.01 v37.61,10
  Bottom 0.203: J9.2 34.51,3.37 35.06,3.92 35.06,9.29 35.77,10 v37.61,10
PWM1  (via drill 0.25)
  Top 0.203: U4.10 28.24,14.2 25.58,16.86 25.58,20.12 23.69,22.01 v23.1,22.01 v23.09,22.02
  Top 0.305: U2.4 20.09,26.87 19.51,26.3 19.51,25.33 v19.53,25.31 | U2.6 21.82,25.3 v20.95,25.3
  Bottom 0.203: v20.95,25.3 21.85,24.39 21.85,23.29 23.09,22.05 v23.09,22.02
  Bottom 0.305: v20.95,25.3 19.51,25.3 v19.53,25.31
PWM2
  Top 0.203: U4.11 28.39,13.41 25.11,16.68 25.11,18.73 22.15,21.69 22.15,24.52
  Top 0.305: U2.5 20.31,26.37 20.2,26.25 20.2,24.92 20.58,24.53 22.17,24.53 | U2.7 22.34,24.71 22.17,24.53 | 22.15,24.52 22.17,24.53
RX_BT  (via drill 0.25)
  Top 0.152: v26.35,17.16 26.35,16.62 27.96,15.01 U4.9
  Bottom 0.152: U9.17 17.18,20.07 13.92,23.33 7.5,23.33 5.21,21.03 5.21,17.31 6.41,16.11 25.31,16.11 v26.35,17.16
SCL  (via drill 0.25, 0.35)
  Top 0.152: U4.44 31.27,23.15 | v33.32,25.66
  Top 0.203: v12.58,34.59 J1.5 14.87,29.78 16.22,29.75 17.06,28.91 17.06,22.27 19.8,19.53 v22.28,19.53 | J2.5 23.73,38.05 v23.75,38.06 | J4.5 47.24,31.19 47.24,29.56 48.75,28.06 48.92,27.88 v48.92,26.84 | 31.27,23.15 31.27,24.3 31.74,24.78 31.74,25.27 32.13,25.66 v33.32,25.66
  Top 0.254: J4.5 47.87,32.02 48.2,32.61 48.21,33 47.34,33.64 46.3,33.66 45.34,32.75 40.9,32.75 39.19,34.45 J3.5
  Bottom 0.203: v23.75,38.06 v23.76,38.06 23.03,37.33 21.59,37.33 16.32,35.2 15.09,35.84 v12.58,34.59 | v22.28,19.53 24.63,19.53 26.9,21.8 28.16,21.8 28.7,22.34 28.7,23.02 29.13,23.46 34.46,23.46 35.02,24.01 35.86,24.01 | 35.86,24.01 39.64,24.01 40.23,23.42 42.35,23.42 42.96,24.03 46.8,24.03 48.21,25.44 48.21,26.13 v48.92,26.84 48.92,27.39 49.66,28.14 52.01,28.14 52.36,27.79 53.92,27.79 54.57,27.14 R9.1 | v33.32,25.66 34.21,25.66 35.86,24.01
  Bottom 0.305: U3.3 55.46,26.26 54.57,27.14
SDA  (via drill 0.25, 0.35)
  Top 0.203: v29.5,22.68 29.5,21.41 U4.1 29.04,21.38 v27.79,22.63 | v13.87,34.23 J1.4 15.7,30.36 16.51,30.36 16.54,30.39 17.69,29.25 17.69,22.82 20.1,20.4 21.23,20.4 v21.25,20.42 | J2.4 v24.73,37.53 v24.74,37.53 | J4.4 47.88,30.43 47.88,29.67 49.92,27.63 49.92,27.45 v49.97,27.4
  Top 0.254: J3.4 40.19,34.28 41.27,33.2 44.92,33.2 45.81,34.09 47.52,34.09 49,33.05 49.15,32.16 48.58,31.34 J4.4
  Bottom 0.152: v29.5,22.68 29.52,22.66 | 54.19,25.54 U3.2
  Bottom 0.203: 29.52,22.66 34.17,22.66 35.08,23.57 39.47,23.57 40.03,23.01 42.55,23.01 43.19,23.65 46.93,23.65 49.97,26.69 v49.97,27.4 51.86,27.4 52.14,27.12 53.05,27.12 R8.1 | v24.74,37.53 v24.74,37.52 24.16,36.95 21.66,36.95 16.08,34.65 15.42,35.02 v13.87,34.23 | v21.25,20.42 24.71,20.42 26.92,22.63 v27.79,22.63
  Bottom 0.254: 54.19,26.01 54.19,25.54
  Bottom 0.305: U3.2 54.19,26.01 54.19,26.03 53.08,27.14 R8.1
SENS_DRV  (via drill 0.25)
  Top 0.305: U2.11 24.89,25.41 v25.22,25.08 | v25.76,29.28 25.31,29.28 24.89,28.87 U2.15
  Top 0.356: v25.22,25.08 26.16,24.14 28.8,24.14 29.85,25.19 R1.2 30.13,26.45 31.07,27.38 31.07,28.28 31.64,28.84 R10.2
  Bottom 0.305: v25.22,25.08 25.79,25.08 26.98,26.28 26.98,28.83 26.53,29.28 v25.76,29.28
SENS_MAG  (via drill 0.25)
  Top 0.203: U4.22 39.26,10.63 38.74,10.11 v38.74,10.01
  Bottom 0.203: v38.74,10.01 38.55,10.01 37.41,8.88 R34.1 36.81,9.46 35.88,9.46 35.49,9.07 35.49,2.54 J9.3
SLEEP_DRV
  Top 0.152: U4.13 32.08,10.64 31.88,10.45 31.09,10.45 29.66,11.88 29.66,12.21 29.04,12.83 28.28,12.83 24.7,16.41 24.7,18.39 21.4,21.69 19.83,21.69 18.27,23.26 18.27,26.96 18.53,27.23 R30.2
  Top 0.305: U2.3 19.12,27.37 R30.2
STATE_BT  (via drill 0.25)
  Top 0.152: v32.92,13.69 32.89,13.66 32.89,13.3 33.68,12.52 U4.15
  Bottom 0.152: U9.22 17.04,23.82 16.55,24.31 7.19,24.31 4.22,21.34 4.22,17.01 6.14,15.1 24.32,15.1 25.85,13.56 26.5,12.91 32.17,12.91 32.92,13.66 v32.92,13.69
SWDCLK_BT  (via drill 0.25)
  Top 0.152: U4.33 40.16,21.38 39.1,20.32 38.12,20.32 v37.85,20.05
  Bottom 0.152: U9.6 9.98,18.9 9.98,17.65 10.37,17.26 24.5,17.26 26.34,19.09 28.07,19.09 28.33,19.35 37.15,19.35 v37.85,20.05
SWDIO_BT  (via drill 0.25)
  Top 0.152: U4.32 40.04,20.6 38.98,19.54 v38.81,19.54
  Bottom 0.152: U9.5 9.21,17.6 9.95,16.86 24.63,16.86 26.52,18.75 28.24,18.75 28.48,19 38.27,19 v38.81,19.54
SWO_BT  (via drill 0.25)
  Top 0.203: v38.46,21.59 39.26,22.39 U4.34
  Bottom 0.152: U9.9 12.23,18.9
  Bottom 0.203: 12.23,18.9 12.23,18.01 12.54,17.7 24.47,17.7 26.2,19.43 27.82,19.43 28.17,19.78 36.38,19.78 37.91,21.31 38.18,21.31 v38.46,21.59
SYNC_REG  (via drill 0.25)
  Top 0.203: U4.35 38.48,22.54 37.56,21.62 v37.04,21.62 | U1.5 32.57,2.75 v32.34,2.99 | v27.34,17.78 v27.35,17.78 27.35,20.18 v27.36,20.19
  Bottom 0.152: v32.34,2.99 32.34,4.52 33.06,5.24 33.06,12.76 33.71,13.41 33.71,14.1 33.37,14.44 30.7,14.44 27.35,17.78 v27.34,17.78
  Bottom 0.203: v37.04,21.62 35.62,20.2 v27.36,20.2 v27.36,20.19
TX_BT  (via drill 0.25)
  Top 0.152: v27.36,16.7 28.26,15.8 U4.8
  Bottom 0.152: U9.19 17.33,21.57 15.24,23.66 7.41,23.66 4.87,21.12 4.87,17.22 6.39,15.71 26.48,15.71 27.36,16.58 v27.36,16.7
V+  (via drill 0.51, 0.64)
  Top 0.305: U2.13 26.4,27.36 C10.2
  Top 0.356: C10.2 | v53.99,34.08 55.49,34.08 57.02,32.54 57.02,29.65 59.44,27.22 59.44,24.55 58.8,23.9 v58.15,23.9
  Top 0.406: J2.1 27.73,37.05 25.6,39.18 23.28,39.18 22.73,38.63 22.73,37.45 19.79,34.51 19.79,34 J1.1
  Top 0.508: C15.1 C10.2 | J4.1 53.64,33.2 v53.99,34.08 | J3.1 43.19,36.25 43.69,36.75 45.83,36.75 v47.51,38.43
  Top 0.61: J2.1 27.73,32.6 28.53,31.81 v29.13,31.81 v29.13,31.8 27.71,30.38 C15.1
  Bottom 0.203: 35.93,12 R26.2
  Bottom 0.254: 35.93,11.44 R26.2
  Bottom 0.305: J9.5 37.51,7.16 38.41,8.06 39.36,8.06 39.87,8.57 39.87,10.58 39.28,11.17 36.2,11.17 35.93,11.44 | 35.93,12 37.24,13.31 39.74,13.31 39.96,13.53 39.96,16.45 42.66,19.14 42.66,20.52 45.2,23.06 56.96,23.06 57.41,23.51 57.76,23.51 v58.15,23.9
  Bottom 0.61: Q9.6 Q9.5 50.56,37.88 48.94,39.51 R51.2 44.95,40.15 arc45 40.22,42.11 36.59,42.11 35.47,40.99 35.47,34.99 34.11,33.63 30.95,33.63 v29.13,31.81 | v53.99,34.08 53.98,34.09 50.9,34.09 Q9.8 Q9.7 49.33,35.34 48.57,36.1 48.57,37.36 v47.51,38.43
  Bottom 0.813: Q9.7 Q9.6
VBAT  (via drill 0.55)
  Top 0.305: C32.1 35.99,2.24 35.33,2.24 35.2,2.38 U1.8 35.2,2.22 34.91,1.93 32.17,1.93 31.44,2.66 31.44,3.8 30.16,5.08 | R55.2 26.88,8.78
  Top 0.356: 30.16,5.08 30.39,5.08 U1.2 U1.3 | 30.3,4.92 31.44,3.78 U1.4
  Top 0.406: U1.3 31.04,4.43 30.39,5.08 C31.1 30.3,4.92 | U8.1 8,18.96 8.8,18.16 11.47,18.16 12.21,18.91 U7.1 12.21,15.83 12.86,15.18
  Top 0.711: C31.1 29.21,5.79 26.88,8.78 24.62,11.67 24.58,11.7 arc45 16.2,15.18 12.86,15.18 8.45,15.18 arc-45 7.58,15.54 6.21,16.91 arc-45 5.17,19.42 5.17,23.17 5.12,32.41 5.12,32.44 arc-45 5.95,34.46 6.78,35.28 arc-45 6.86,35.32 6.98,35.43 20.65,41.28 29.68,41.33 30.43,40.58 30.43,34.91 31.71,33.63 34.51,33.63 35.59,34.71 35.59,40.27 36.28,40.96 v38.5,40.96
  Bottom 0.61: 36.76,31.26 38.69,31.26 D33.C 38.6,30.05 Q88.2 | 36.76,31.26 Q88.1 | Q88.3 36.71,31.2 36.76,31.26
  Bottom 0.711: L1.1 41.88,33.39 40.44,34.83 40.44,36.41 42.07,38.05 42.07,39.94 41.05,40.96 v38.5,40.96
  Bottom 1.016: D33.C 41.94,33.39 L1.1 42.73,33.32 43.28,33.32 44.54,32.06 C16.1
VIN+
  Bottom 0.61: Q88.8 Q88.7 Q88.6 Q88.5 33.28,27.51 35.1,25.69 38.53,25.69 38.63,25.79 J5.1

## Text on the board
bPlace: 3V3-2